# EAGLE design barBloom (EAGLE 7.7.0)
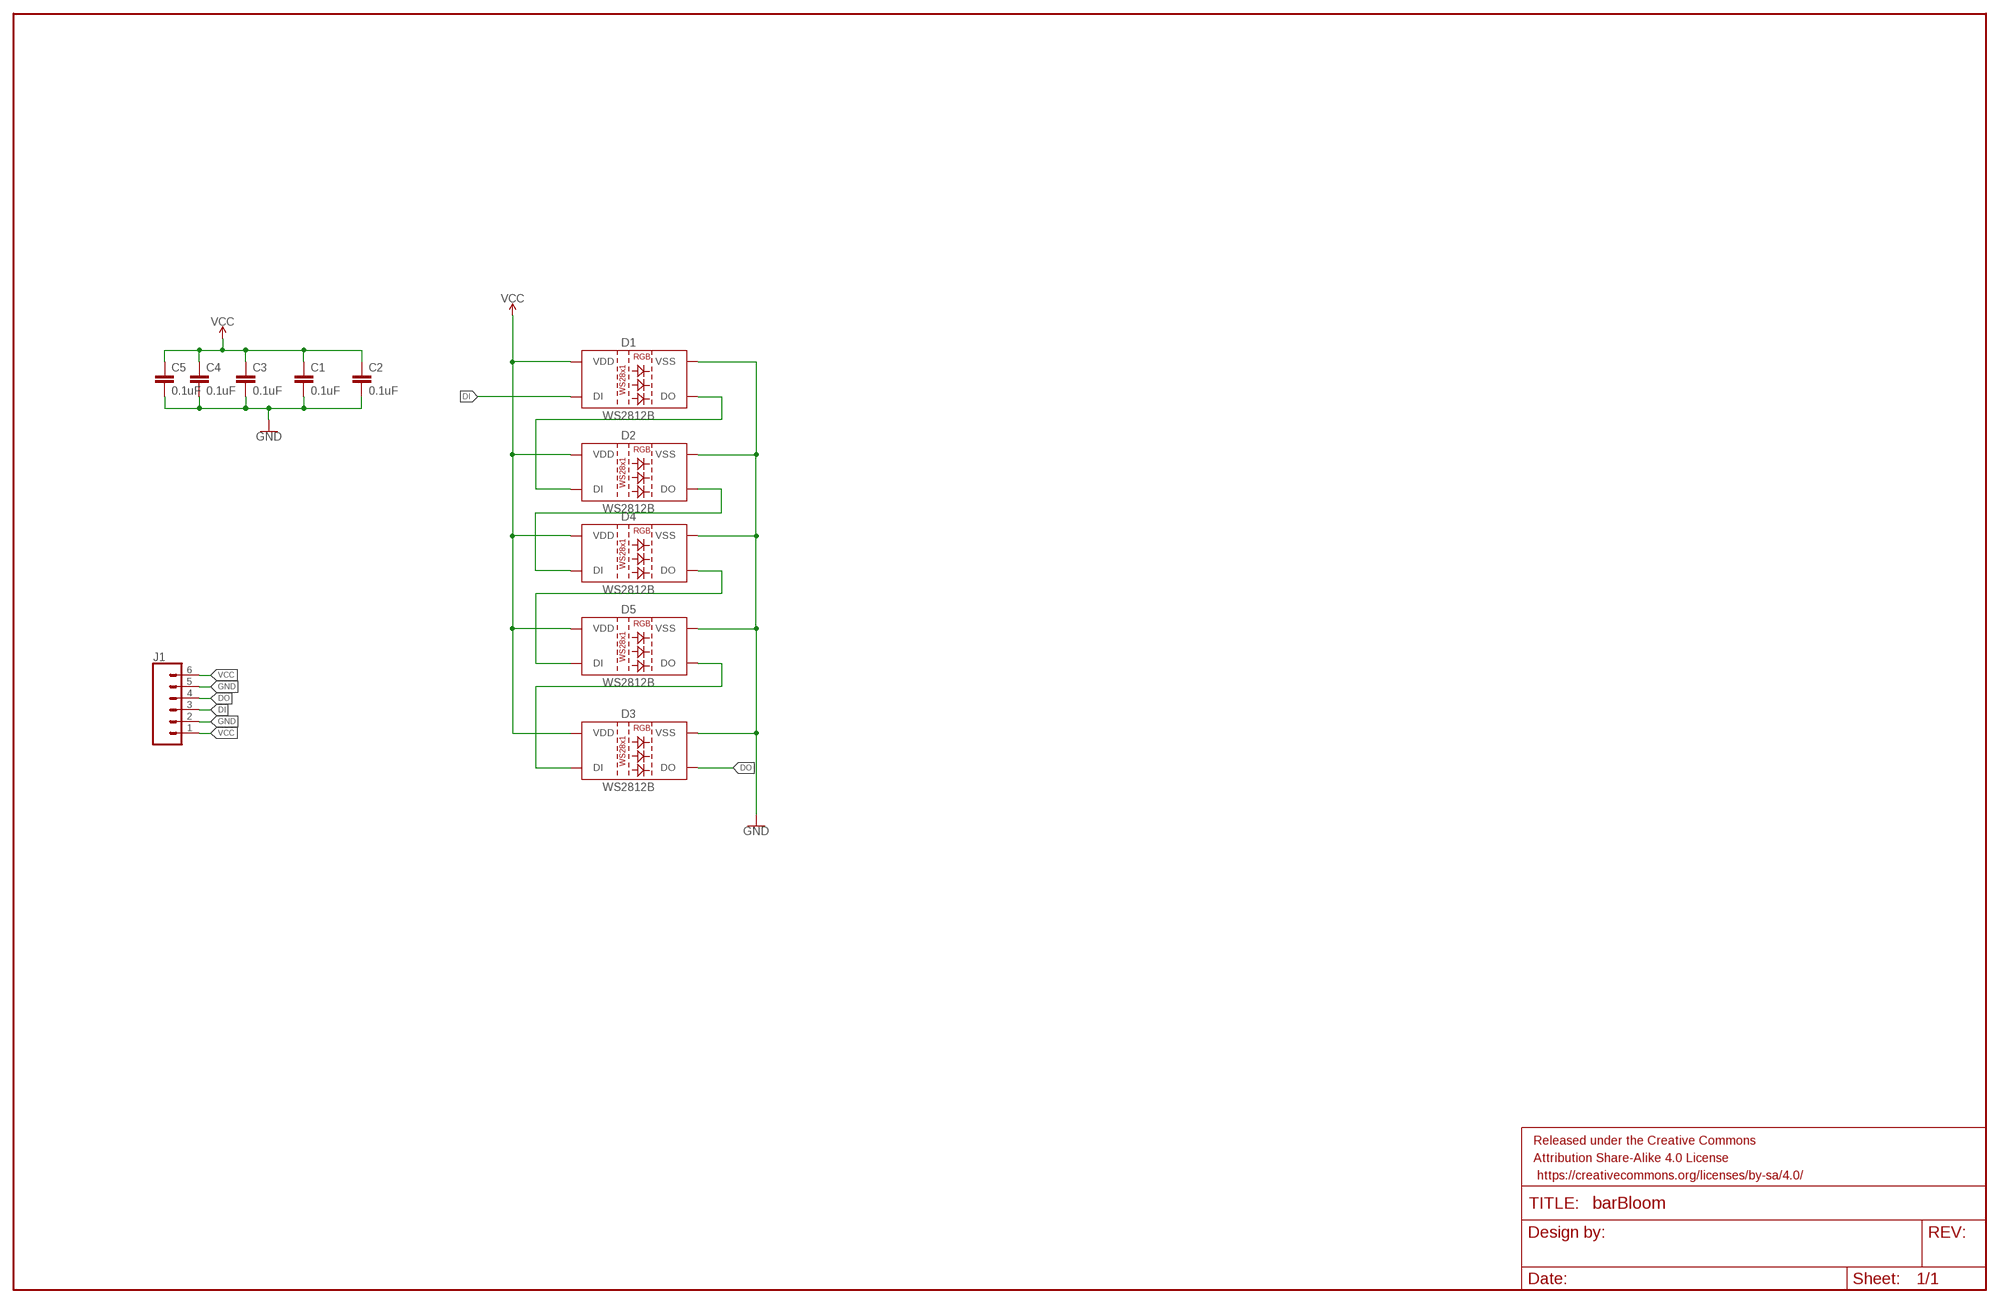
[diagram p0: schematic, sheet 1]

## Parts
C1  0.1uF  0.1UF-0603-25V-(+80/-20%)  [0603]
C2  0.1uF  0.1UF-0603-25V-(+80/-20%)  [0603]
C3  0.1uF  0.1UF-0603-25V-(+80/-20%)  [0603]
C4  0.1uF  0.1UF-0603-25V-(+80/-20%)  [0603]
C5  0.1uF  0.1UF-0603-25V-(+80/-20%)  [0603]
D1  WS2812B  [WS2812B]
D2  WS2812B  [WS2812B]
D3  WS2812B  [WS2812B]
D4  WS2812B  [WS2812B]
D5  WS2812B  [WS2812B]
FRAME1  FRAME-LEDGER  [CREATIVE_COMMONS]
J1  CONN_06SMD-STRAIGHT-ALT-FEMALE  [1X06_SMD_STRAIGHT_ALT]

## Nets
DI: D1.4(DI) J1.3
DO: D3.2(DO) J1.4
GND: C1.2 C2.2 C3.2 C4.2 C5.2 D1.3(VSS) D2.3(VSS) D3.3(VSS) D4.3(VSS) D5.3(VSS) J1.2 J1.5
N$2: D1.2(DO) D2.4(DI)
N$5: D2.2(DO) D4.4(DI)
N$7: D4.2(DO) D5.4(DI)
N$11: D3.4(DI) D5.2(DO)
VCC: C1.1 C2.1 C3.1 C4.1 C5.1 D1.1(VDD) D2.1(VDD) D3.1(VDD) D4.1(VDD) D5.1(VDD) J1.1 J1.6

## Library data of the parts
C1-C5 = SparkFun-Capacitors:0.1UF: 0.1µF ceramic capacitors A capacitor is a passive two-terminal electrical component used to store electrical energy temporarily in an electric field.; PROD_ID: CAP-00810
D1-D5 = SparkFun-LED:WS2812B: WS2812B SMD addressable RGB LED 5x5mm SMD LED with built-in controller IC. Color: Red/Green/Blue mC Rating: RGB: 390, 660, 180 mcd Forward Voltage: RGB: 2.0, 3.0, 3.0 V Packages:WS2812B SparkFun Products: Blynk Board - ESP8266 <https://www.sparkfun.com/products/13794>; PROD_ID: DIO-12503
FRAME1 = SparkFun-Aesthetics:FRAME-LEDGER: Schematic Frame - Ledger Standard 11x14 US Ledger frame
J1 = SparkFun-Connectors:CONN_06: Multi connection point. Often used as Generic Header-pin footprint for 0.1 inch spaced/style header connections On any of the 0.1 inch spaced packages, you can populate with these: Break Away Headers - Straight <https://www.sparkfun.com/products/116> (PRT-00116) Break Away Male Headers - Right Angle <https://www.sparkfun.com/products/553> (PRT-00553) Female Headers <https://www.sparkfun.com/products/115> (PRT-00115) Break Away Headers - Machine Pin <https://www.sparkfun.com/products/117> (PRT-00117) Break Away Female Headers - Swiss Machine Pin <https://www.sparkfun.com/products/743> (PRT-00743) Arduino Stackable Header - 6 Pin <https://www.sparkfun.com/products/9280> (PRT-09280) For SCREWTERMINALS and SPRING TERMINALS visit here: Screw Terimnals on SparkFun.com <https://www.sparkfun.com/search/results?term=Screw+Terminals> (5mm/3.5mm/2.54mm spacing) This device is also useful as a general connection point to wire up your design to another part of your project. Our various solder wires solder well into these plated through hole pads. Hook-Up Wire - Assortment (Stranded, 22 AWG) <https://www.sparkfun.com/products/11375> (PRT-11375) Hook-Up Wire - Assortment (Solid Core, 22 AWG) <https://www.sparkfun.com/products/11367> (PRT-11367) View the entire wire category on our website here <https://www.sparkfun.com/categories/141>; PROD_ID: CONN-10203

## Board
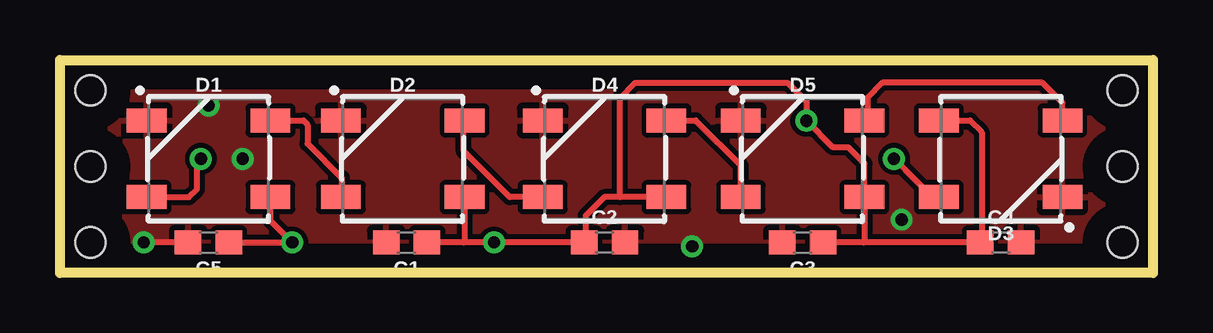
[diagram p1: board, top side]
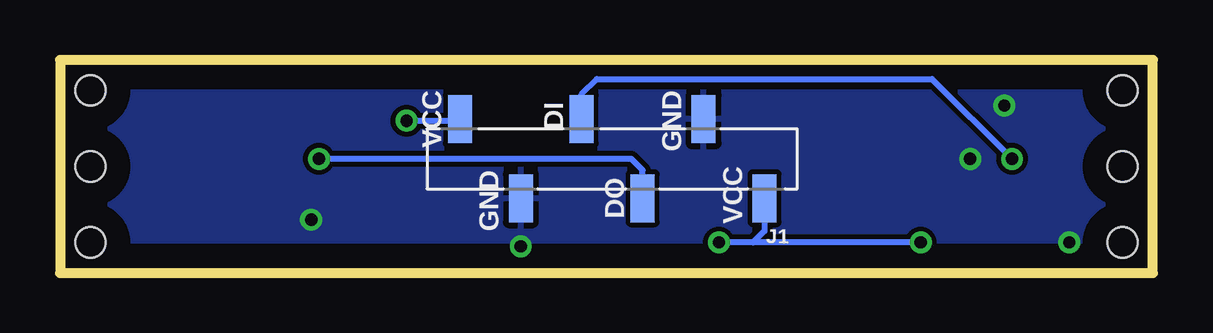
[diagram p2: board, bottom side, seen from below]

Size 45.56 x 8.89 mm. Coordinates in mm from the lower left corner, seen from the top.
Outline: 45.56,8.89 45.56,0 0,0 0,8.89 45.56,8.89
Copper layers (1*16): Top 0.035mm / dielectric 1.5mm / Bottom 0.035mm
Design rules "default": minimum track width 10mil, minimum drill 24mil, track to track 8mil, track to pad 8mil, pad to pad 8mil, via to via 8mil, smd to smd 8mil, copper to edge 40mil, drill to drill 8mil, minimum pad ring 10mil, minimum via ring 8mil, stop-mask expansion 4mil, vias tented up to drill 0mil, thermal gap 10mil
Holes 1.27 mm at 44.29,1.27 44.29,7.62 1.27,1.27 1.27,7.62 1.27,4.45 44.29,4.45

### Footprints (pad centres in the part's own frame; a part is rotated, then mirrored left to right if it is on the bottom)
0603 = smd 1.1 x 1: 1 -0.85,0; 2 0.85,0
WS2812B = smd 1.651 x 1: 1 2.577,-1.6; 2 2.577,1.6; 3 -2.577,1.6; 4 -2.577,-1.6
1X06_SMD_STRAIGHT_ALT = smd 1 x 2: 1 0,-1.65; 2 -2.54,1.65; 3 -5.08,-1.65; 4 -7.62,1.65; 5 -10.16,-1.65; 6 -12.7,1.65

### Placement (x,y rotation side)
C1  14.45,1.27 180 top
C2  22.7,1.27 0 top
C3  30.96,1.27 180 top
C4  39.21,1.27 0 top
C5  6.19,1.27 180 top
D1  6.19,4.76 0 top
D2  14.29,4.76 0 top
D3  39.21,4.76 180 top
D4  22.7,4.76 0 top
D5  30.96,4.76 0 top
FRAME1  -101.6,1.27 0 top  (outside the outline)
J1  28.89,4.76 180 bottom

### Tracks (layer width: path | path; a pad name or v marks a point on that pad's centre or on a via)
DI  (via drill 0.51)
  Top 0.254: D1.4 5.38,3.16 5.71,3.49 5.71,4.6 v5.87,4.76
  Bottom 0.254: J1.3 23.81,7.46 23.18,8.1 9.21,8.1 5.95,4.84 v5.87,4.76
DO  (via drill 0.51)
  Top 0.254: D3.2 36.37,3.16 35.24,4.29 v34.77,4.76
  Bottom 0.254: J1.4 21.27,4.29 21.75,4.76 v34.77,4.76
GND  (via drill 0.51)
  Top 0.254: C5.2 v3.49,1.27
  other vias: 6.19,6.99 7.62,4.76 26.35,1.11 35.08,2.22
  pour Top: 45.56,8.89 45.56,0 0,0 0,8.89
  pour Bottom: 45.56,8.89 45.56,0 0,0 0,8.89
N$2
  Top 0.254: D1.2 10.15,6.36 10.32,6.19 10.32,5.4 11.75,3.97 11.75,3.2 D2.4
N$5
  Top 0.254: D4.4 18.75,3.16 16.83,5.08 16.83,6.33 D2.2
N$7
  Top 0.254: D5.4 28.38,4.48 26.5,6.36 D4.2
N$11
  Top 0.254: D3.4 41.79,7.11 40.96,7.94 34.29,7.94 33.66,7.3 33.66,6.48 D5.2
VCC  (via drill 0.51)
  Top 0.254: 33.5,1.27 C4.1 38.42,1.33 38.42,5.87 37.93,6.36 D3.1 | 33.5,1.27 C3.1 | 16.83,1.27 v18.1,1.27 C2.1 21.91,1.33 21.91,2.38 22.69,3.16 D4.1 23.35,3.16 23.34,3.17 23.34,7.3 23.97,7.94 30.32,7.94 31.11,7.14 v31.11,6.35 32.23,5.24 32.86,5.24 33.53,4.57 D5.1 33.53,1.31 33.5,1.27 | 16.83,1.27 C1.1 | D2.1 16.86,1.31 16.83,1.27 | D1.1 8.77,2.19 v9.68,1.27 C5.1
  Bottom 0.254: v31.11,6.35 28.95,6.35 J1.1 | J1.6 16.19,1.75 16.67,1.27 v18.1,1.27 v9.68,1.27

### Text on the board
bPlace: GND | VCC | DI | VCC | DO | GND